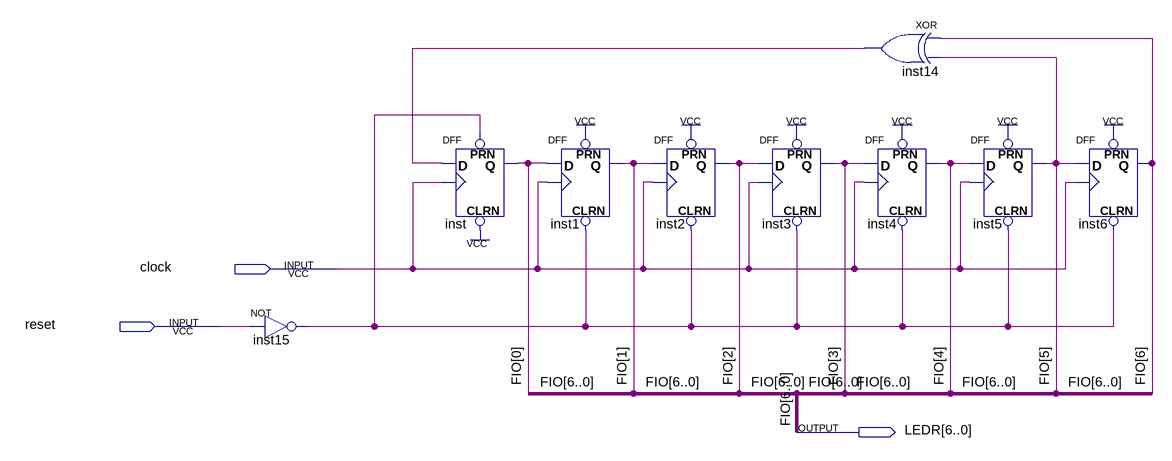
[diagram p0: schematic sheet]
// Quartus schematic lfsr_senha.bdf as structural Verilog: 9 symbols, 3 pins
module lfsr_senha (
  input  clock,
  input  reset,
  output [6:0] LEDR
);

  wire inst14_out, inst15_out;

  not inst15 (inst15_out, reset);
  DFF inst (.CLRN(1'b1), .CLK(clock), .D(inst14_out), .PRN(inst15_out), .Q(LEDR[0]));
  DFF inst1 (.CLRN(inst15_out), .CLK(clock), .D(LEDR[0]), .PRN(1'b1), .Q(LEDR[1]));
  DFF inst2 (.CLRN(inst15_out), .CLK(clock), .D(LEDR[1]), .PRN(1'b1), .Q(LEDR[2]));
  DFF inst3 (.CLRN(inst15_out), .CLK(clock), .D(LEDR[2]), .PRN(1'b1), .Q(LEDR[3]));
  xor inst14 (inst14_out, LEDR[6], LEDR[5]);
  DFF inst4 (.CLRN(inst15_out), .CLK(clock), .D(LEDR[3]), .PRN(1'b1), .Q(LEDR[4]));
  DFF inst5 (.CLRN(inst15_out), .CLK(clock), .D(LEDR[4]), .PRN(1'b1), .Q(LEDR[5]));
  DFF inst6 (.CLRN(inst15_out), .CLK(clock), .D(LEDR[5]), .PRN(1'b1), .Q(LEDR[6]));

  // Other names for the same wires on the sheet: FIO[6:0] = LEDR
endmodule
